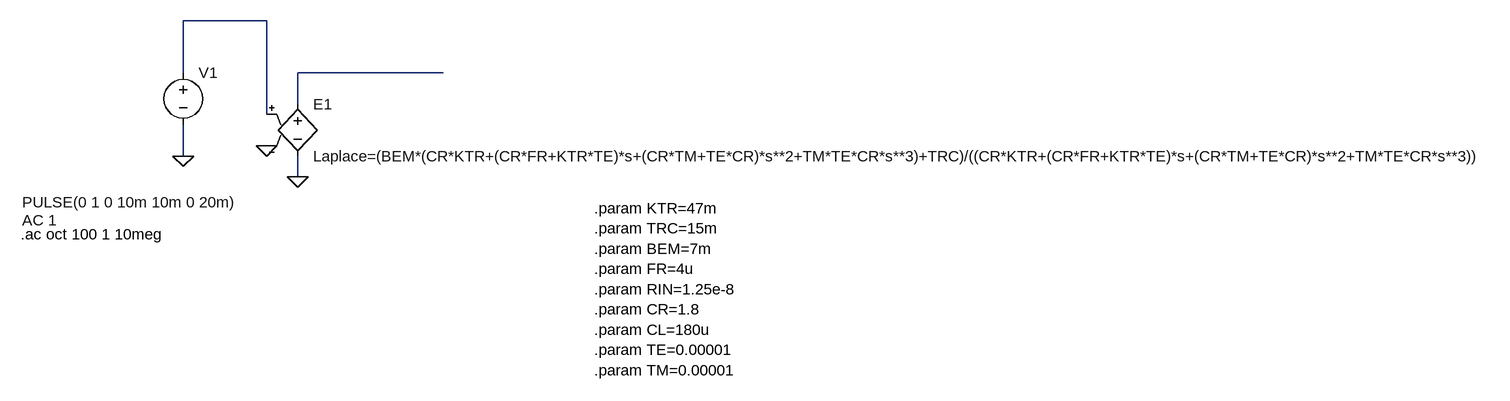
[diagram p0: schematic Draft3.asc]
Draft3.asc, the LTspice schematic file:
Version 4
SHEET 1 1852 680
WIRE -288 -160 -416 -160
WIRE -416 -80 -416 -160
WIRE -16 -80 -240 -80
WIRE -240 -32 -240 -80
WIRE -288 -16 -288 -160
WIRE -416 48 -416 0
WIRE -240 80 -240 48
FLAG -240 80 0
FLAG -416 48 0
FLAG -288 32 0
SYMBOL e -240 -48 R0
SYMATTR InstName E1
SYMATTR Value Laplace=(BEM*(CR*KTR+(CR*FR+KTR*TE)*s+(CR*TM+TE*CR)*s**2+TM*TE*CR*s**3)+TRC)/((CR*KTR+(CR*FR+KTR*TE)*s+(CR*TM+TE*CR)*s**2+TM*TE*CR*s**3))
SYMBOL voltage -416 -96 R0
WINDOW 123 -248 243 Left 2
WINDOW 39 0 0 Left 2
WINDOW 3 -248 215 Left 2
SYMATTR Value2 AC 1
SYMATTR InstName V1
SYMATTR Value PULSE(0 1 0 10m 10m 0 20m)
TEXT -666 168 Left 2 !.ac oct 100 1 10meg
TEXT 216 128 Left 2 !.param KTR=47m\n.param TRC=15m\n.param BEM=7m\n.param FR=4u\n.param RIN=1.25e-8\n.param CR=1.8\n.param CL=180u\n.param TE=0.00001\n.param TM=0.00001

The netlist it stands for:
* Draft3.asc
E1 N002 0 N001 0 Laplace=(BEM*(CR*KTR+(CR*FR+KTR*TE)*s+(CR*TM+TE*CR)*s**2+TM*TE*CR*s**3)+TRC)/((CR*KTR+(CR*FR+KTR*TE)*s+(CR*TM+TE*CR)*s**2+TM*TE*CR*s**3))
V1 N001 0 PULSE(0 1 0 10m 10m 0 20m) AC 1
.ac oct 100 1 10meg
.param KTR=47m
.param TRC=15m
.param BEM=7m
.param FR=4u
.param RIN=1.25e-8
.param CR=1.8
.param CL=180u
.param TE=0.00001
.param TM=0.00001
.backanno
.end